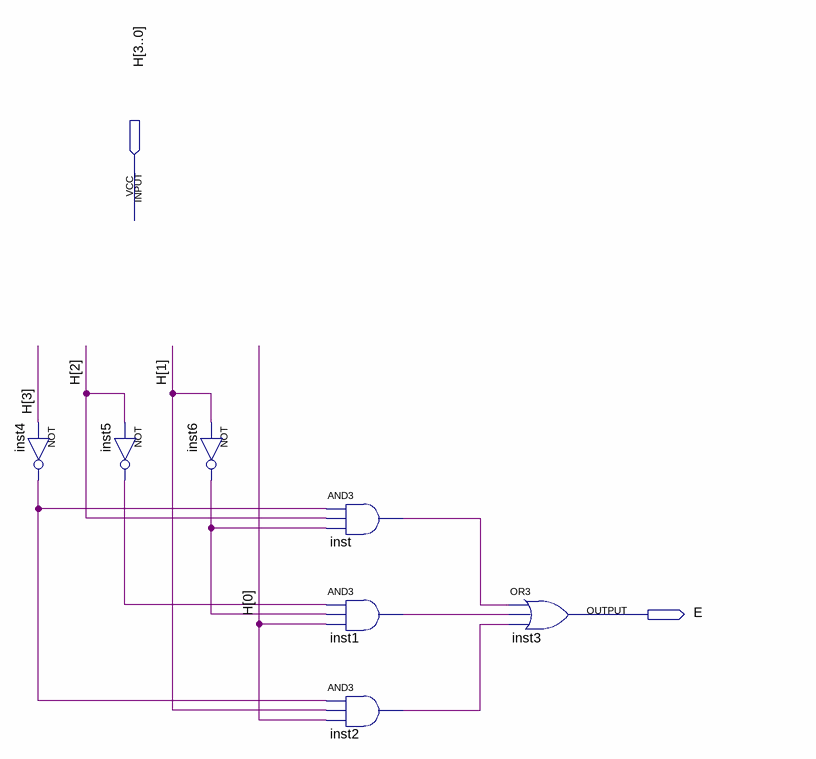
[diagram p0: schematic sheet]
// Quartus schematic E_Logic.bdf as structural Verilog: 7 symbols, 2 pins
module E_Logic (
  input  [3:0] H,
  output E
);

  wire inst1_out, inst2_out, inst4_out, inst5_out, inst6_out, inst_out;

  not inst4 (inst4_out, H[3]);
  not inst5 (inst5_out, H[2]);
  not inst6 (inst6_out, H[1]);
  and inst (inst_out, inst4_out, H[2], inst6_out);
  and inst1 (inst1_out, inst5_out, inst6_out, H[0]);
  and inst2 (inst2_out, inst4_out, H[1], H[0]);
  or inst3 (E, inst_out, inst1_out, inst2_out);
endmodule
